# Altium schematic sheet MCU.SchDoc
size A3; SheetNumber: 1; SheetTotal: 1
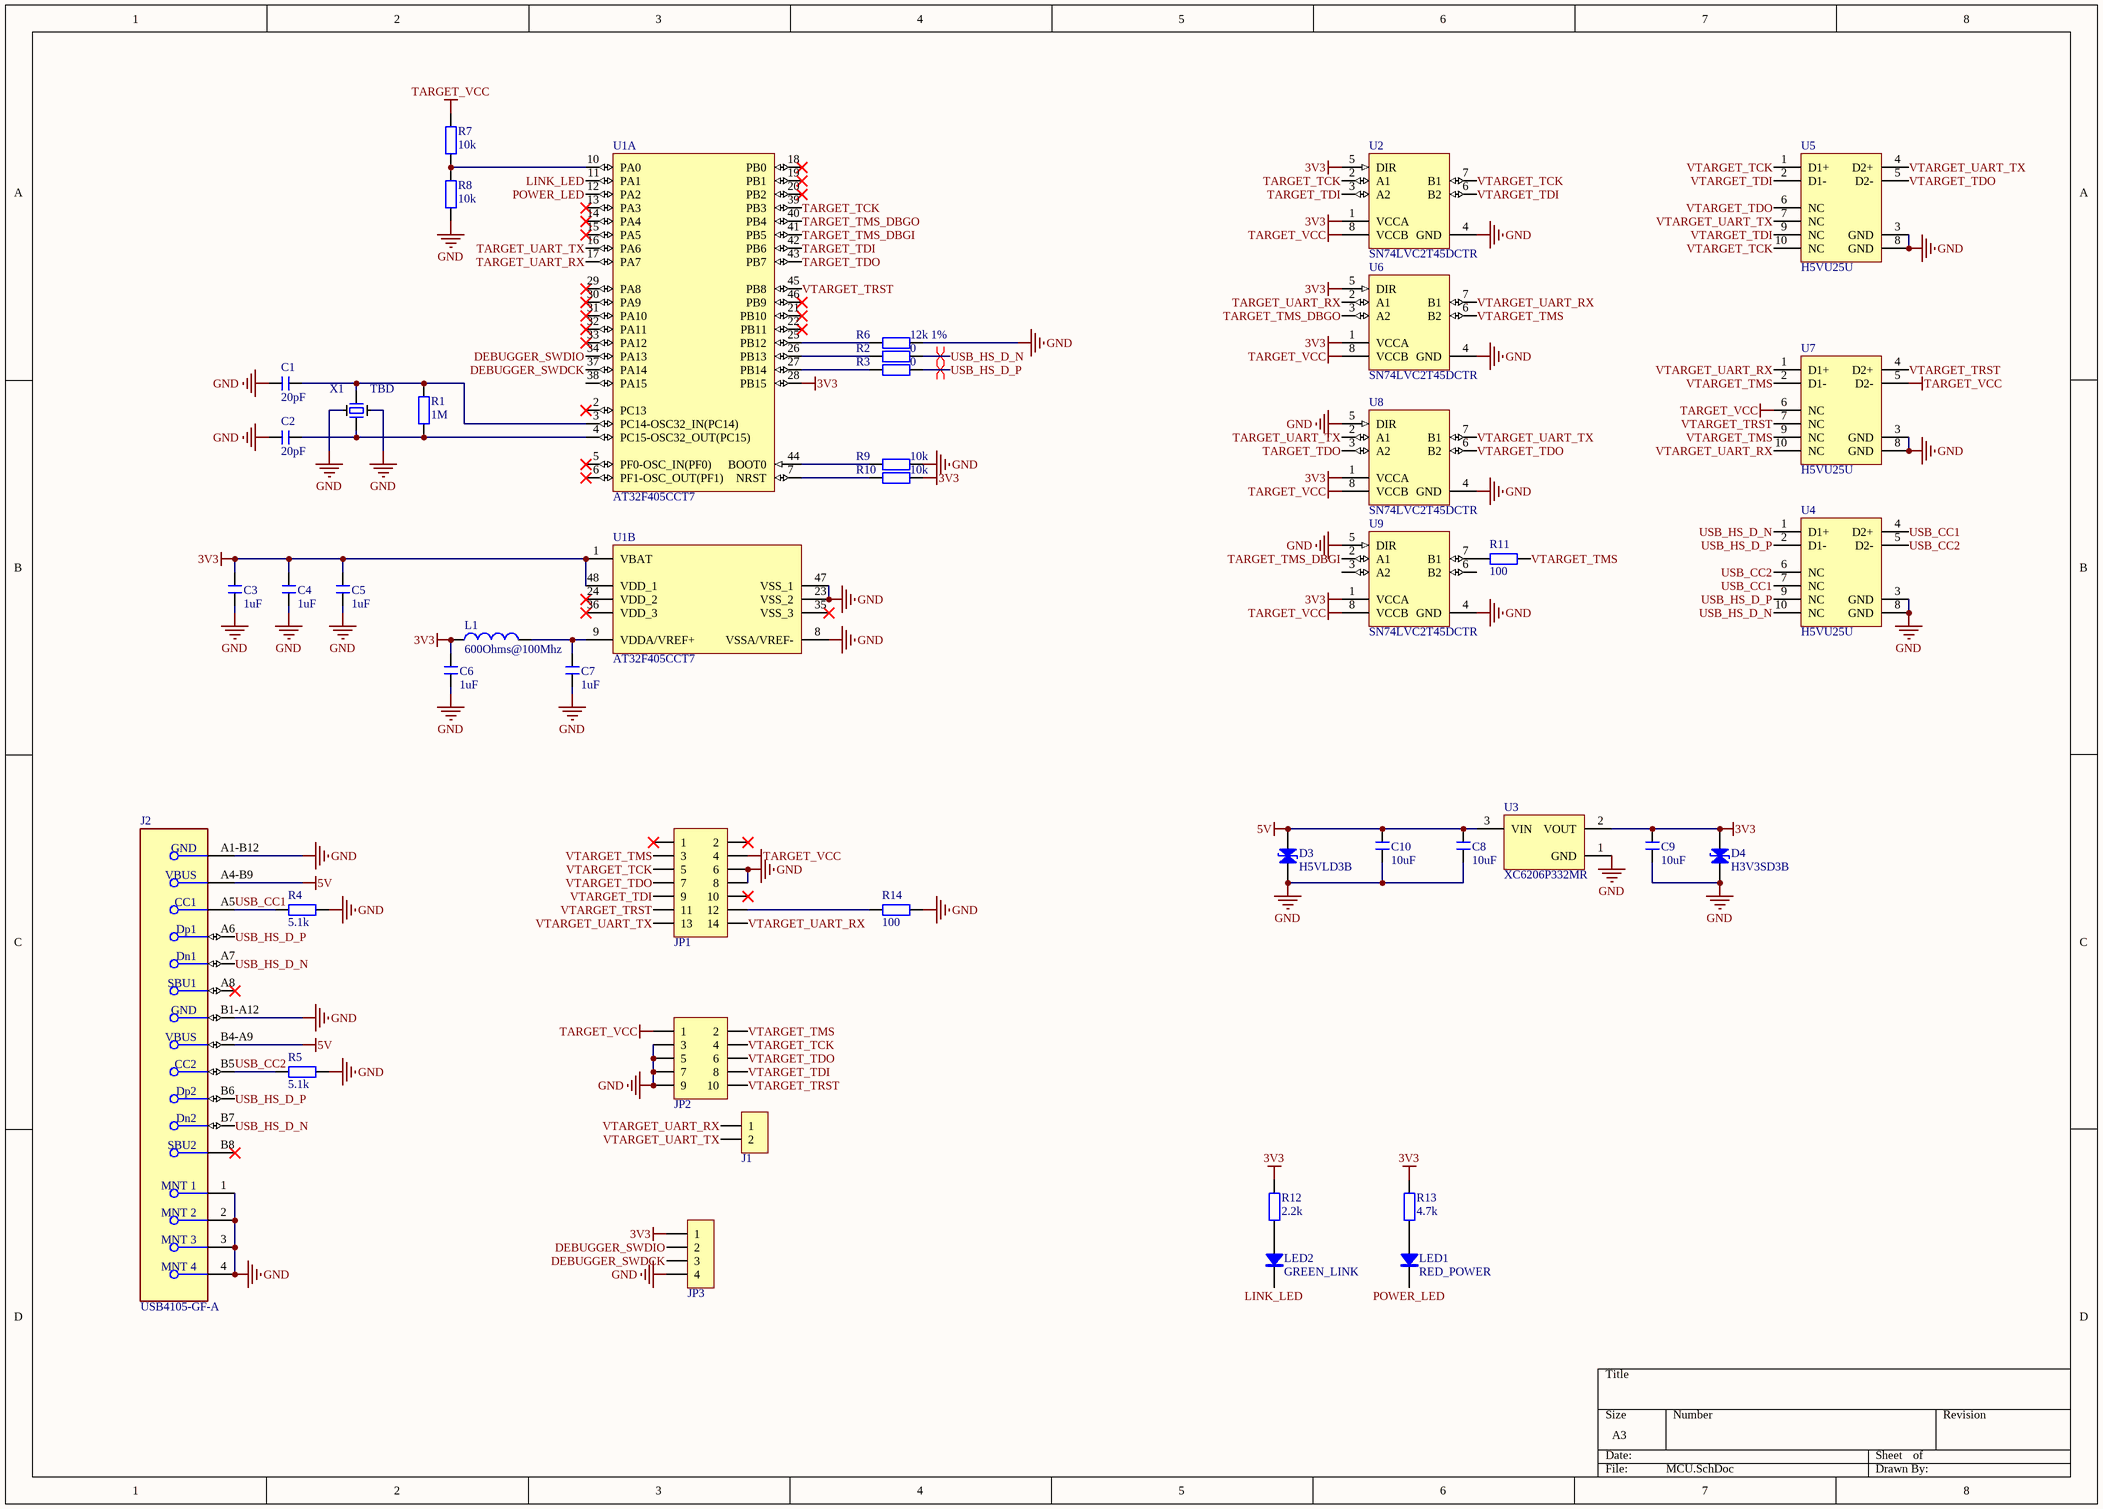
[diagram p0: MCU.SchDoc]

## Parts
C1  20pF  [C0402]
C2  20pF  [C0402]
C3  1uF  [C0402]
C4  1uF  [C0402]
C5  1uF  [C0402]
C6  1uF  [C0402]
C7  1uF  [C0402]
C8  10uF  [C0603]
C9  10uF  [C0603]
C10  10uF  [C0603]
D3  H5VLD3B  [SOD-323]
D4  H3V3SD3B  [SOD-323]
J1  HDR-1X2  [HDR2.54-LI-2P]  (value not drawn)
J2  USB4105-GF-A  [FP-USB4105-GF-A-MFG]
JP1  Header 2X7  [HDR1.27-LI-2x7P]  (value not drawn)
JP2  Header 5X2  [HDR2.54-LI-2x5P]  (value not drawn)
JP3  HDR-1X4  [HDR2.54-WS-4P]  (value not drawn)
L1  600Ohms@100Mhz  [L 0603_L]
LED1  RED_POWER  [LED 0603R]
LED2  GREEN_LINK  [LED 0603G]
R1  1M  [R0402]
R2  0  [R0402]
R3  0  [R0402]
R4  5.1k  [R0402]
R5  5.1k  [R0402]
R6  12k 1%  [R0402]
R7  10k  [R0402]
R8  10k  [R0402]
R9  10k  [R0402]
R10  10k  [R0402]
R11  100  [R0402]
R12  2.2k  [R0402]
R13  4.7k  [R0402]
R14  100  [R0402]
U1  AT32F405CCT7  [STM-LQFP48_N]  (parts A,B of 2)
U2  SN74LVC2T45DCTR  [DCT0008A_N]
U3  XC6206P332MR  [SOT-23-TT3_N]
U4  H5VU25U  [DQA0010A_V]
U5  H5VU25U  [DQA0010A_V]
U6  SN74LVC2T45DCTR  [DCT0008A_N]
U7  H5VU25U  [DQA0010A_V]
U8  SN74LVC2T45DCTR  [DCT0008A_N]
U9  SN74LVC2T45DCTR  [DCT0008A_N]
X1  TBD  [3225]

## Nets
3V3: C3.1 C4.1 C5.1 C6.1 C9.1 D4.1(A) JP3.1 L1.1 R10.1 R12.1 R13.1 U1.1(VBAT) U1.28(PB15) U1.48(VDD_1) U2.1(VCCA) U2.5(DIR) U3.2(VOUT) U6.1(VCCA) U6.5(DIR) U8.1(VCCA) U9.1(VCCA)
5V: C8.1 C10.1 D3.1(A) J2.A4-B9(VBUS) J2.B4-A9(VBUS) U3.3(VIN)
GND: C1.2 C2.2 C3.2 C4.2 C5.2 C6.2 C7.2 C8.2 C9.2 C10.2 D3.2(K) D4.2(K) J2.1(MNT_1) J2.2(MNT_2) J2.3(MNT_3) J2.4(MNT_4) J2.A1-B12(GND) J2.B1-A12(GND) JP1.6 JP1.8 JP2.3 JP2.5 JP2.7 JP2.9 JP3.4 R4.1 R5.1 R6.1 R8.1 R9.1 R14.1 U1.8(VSSA/VREF-) U1.23(VSS_2) U1.47(VSS_1) U2.4(GND) U3.1(GND) U4.3(GND) U4.8(GND) U5.3(GND) U5.8(GND) U6.4(GND) U7.3(GND) U7.8(GND) U8.4(GND) U8.5(DIR) U9.4(GND) U9.5(DIR) X1.2 X1.4
TARGET_VCC: JP1.4 JP2.1 R7.2 U2.8(VCCB) U6.8(VCCB) U7.5(D2-) U7.6(NC) U8.8(VCCB) U9.8(VCCB)
DEBUGGER_SWDCK: JP3.3 U1.37(PA14)
DEBUGGER_SWDIO: JP3.2 U1.34(PA13)
LINK_LED: LED2.2(K) U1.11(PA1)
POWER_LED: LED1.2(K) U1.12(PA2)
TARGET_TCK: U1.39(PB3) U2.2(A1)
TARGET_TDI: U1.42(PB6) U2.3(A2)
TARGET_TDO: U1.43(PB7) U8.3(A2)
TARGET_TMS_DBGI: U1.41(PB5) U9.2(A1)
TARGET_TMS_DBGO: U1.40(PB4) U6.3(A2)
TARGET_UART_RX: U1.17(PA7) U6.2(A1)
TARGET_UART_TX: U1.16(PA6) U8.2(A1)
USB_CC1: J2.A5(CC1) R4.2 U4.4(D2+) U4.7(NC)
USB_CC2: J2.B5(CC2) R5.2 U4.5(D2-) U4.6(NC)
USB_HS_D_N: J2.A7(Dn1) J2.B7(Dn2) R2.1 U4.1(D1+) U4.10(NC)
USB_HS_D_P: J2.A6(Dp1) J2.B6(Dp2) R3.1 U4.2(D1-) U4.9(NC)
VTARGET_TCK: JP1.5 JP2.4 U2.7(B1) U5.1(D1+) U5.10(NC)
VTARGET_TDI: JP1.9 JP2.8 U2.6(B2) U5.2(D1-) U5.9(NC)
VTARGET_TDO: JP1.7 JP2.6 U5.5(D2-) U5.6(NC) U8.6(B2)
VTARGET_TMS: JP1.3 JP2.2 R11.1 U6.6(B2) U7.2(D1-) U7.9(NC)
VTARGET_TRST: JP1.11 JP2.10 U1.45(PB8) U7.4(D2+) U7.7(NC)
VTARGET_UART_RX: J1.1 JP1.14 U6.7(B1) U7.1(D1+) U7.10(NC)
VTARGET_UART_TX: J1.2 JP1.13 U5.4(D2+) U5.7(NC) U8.7(B1)
NetC1_1: C1.1 R1.2 U1.3(PC14-OSC32_IN(PC14)) X1.3
NetC2_1: C2.1 R1.1 U1.4(PC15-OSC32_OUT(PC15)) X1.1
NetC7_1: C7.1 L1.2 U1.9(VDDA/VREF+)
NetJP1_12: JP1.12 R14.2
NetLED1_1: LED1.1(A) R13.2
NetLED2_1: LED2.1(A) R12.2
NetR2_2: R2.2 U1.26(PB13)
NetR3_2: R3.2 U1.27(PB14)
NetR6_2: R6.2 U1.25(PB12)
NetR7_1: R7.1 R8.2 U1.10(PA0)
NetR9_2: R9.2 U1.44(BOOT0)
NetR10_2: R10.2 U1.7(NRST)
NetR11_2: R11.2 U9.7(B1)

Not connected (* = marked no-connect by the designer): J2 A8(SBU1)* B8(SBU2)*; JP1 1* 2* 10*; U1 2(PC13)* 5(PF0-OSC_IN(PF0))* 6(PF1-OSC_OUT(PF1))* 13(PA3)* 14(PA4)* 15(PA5)* 18(PB0)* 19(PB1)* 20(PB2)* 21(PB10)* 22(PB11)* 24(VDD_2)* 29(PA8)* 30(PA9)* 31(PA10)* 32(PA11)* 33(PA12)* 35(VSS_3)* 36(VDD_3)* 38(PA15) 46(PB9)*; U9 3(A2) 6(B2)

## Layout directives
differential pair: USB_HS_D_N, USB_HS_D_P

## Library data of the parts
C1-C10 = C
D3 D4 = Generic_BiTVS: 瞬态电压抑制二极管; 版权归属: 源创客; BOM名称: 瞬态电压抑制二极管; 学习资源: www.ooocke.com
J1 = Header 2: BOM名称: 2P接插件; 版权归属: 源创客; 学习资源: www.ooocke.com
J2 = CMP-245163-000001-1: CONN RCPT USB2.0 TYPEC 5A; Manufacturer: GCT; Voltage Rating: 20V; Is Female: yes; Current Rating: 5/6.25/1.25/0.25A; Number Of Contacts: 16; Conn Orientation: Right Angle; Device Class L1: Connectors; Category: Conn; Lead Free: Yes; RoHS: TRUE; Temperature Range High: +85°C; Digikey Description: CONN RCPT USB2.0 TYPEC 5A; Device Class L3: unset; ComponentLink2Description: Datasheet; Manufacturer Part Number: USB4105-GF-A; Package: 0; Usb Standard: USB 2.0; Device Class L2: USB Connectors; Automotive: No; Temperature Range Low: -40°C; Height: 3.46mm; Temperature: -40°C to +85°C; Contact Material: Gold,Nickel; ComponentLink2URL: https://gct.co/files/drawings/usb4105.pdf; Octopart: https://octopart.com/usb4105-gf-a-gct-106627878
JP1 = Header 7X2: 7*2P接插件; 版权归属: 源创客; BOM名称: 7*2P接插件; 学习资源: www.ooocke.com
JP2 = Header 5X2: 5*2P接插件; 版权归属: 源创客; BOM名称: 5*2P接插件; 学习资源: www.ooocke.com
JP3 = Header 4: 4P接插件; 版权归属: 源创客; BOM名称: 4P接插件; 学习资源: www.ooocke.com
L1 = L
LED1 LED2 = D
R1-R14 = R
U1 = CMP-0572-00014-2: ARM Cortex-M4 32-bit MCU, 128 KB Flash, 32 KB Internal RAM, 37 I/Os, 48-pin LQFP, -40 to 85 degC, Tray; PartNumber: STM32F303CBT6; Internal RAM Size (kB): 32; Supply Voltage(Vcc) min (V): 2; Operating Frequency(F) (Processor speed) (MHz): 72; FLASH Size (Prog) (kB): 128; I/Os (High Current): 37; D/A Converter: 2x12-bit (2 Channel); PackageDescription: 48-Pin Low Profile Quad Flat Package, 7 x 7 mm Body, 0.5 mm Pitch; ComponentLink1URL: http://www.st.com/web/en/home.html; Packing: Tray; ComponentLink1Description: Manufacturer URL; DatasheetVersion: Rev. 6; Mounting Technology: Surface Mount; Core: ARM Cortex-M4; ComponentLink2URL: http://www.st.com/st-web-ui/static/active/en/resource/technical/document/datasheet/DM00058181.pdf; ComponentLink3URL: http://www.st.com/st-web-ui/static/active/en/resource/technical/document/datasheet/DM00058181.pdf; PackageReference: LQFP48; ComponentLink3Description: Package Specification; PackageVersion: Rev. 6, 06/2013; ComponentLink2Description: Datasheet
U2 U6 U8 U9 = CMP-0859-00006-4: Dual-Bit Dual Supply Transceiver with Configurable Voltage Translation and 3-State Outputs, DCT0008A, LARGE T&R; Manufacturer: Texas Instruments; Rating: Military; Input Type: CMOS/TTL; Schmitt Trigger: No; ICC @ Nom Voltage(Max)(mA): 0.004; Bits(#): 2; Logic: True; tpd @ Nom Voltage(Max)(ns): 17.7,10.3,8.3,7.2; VCC(Min)(V): 1.65; Voltage(Nom)(V): 1.8,2.5,3.3,5; Output Type: CMOS; F @ Nom Voltage(Max)(Mhz): 150; Technology Family: LVC; VCC(Max)(V): 5.5; Output Drive (IOL/IOH)(Max)(mA): 32/-32; 3-State Output: Yes; Sub-Family: Dual Supply Translator; Operating Temperature Range(C): -40 to 85; DatasheetVersion: SCES516J; Generic Part Number: SN74LVC2T45; PackageReference: DCT0008A
U3 = CMP-0136-00791-1: Low Quiescent Current LDO, 3-Pin SOT-23, Extended Temperature, Tape and Reel; PackageVersion: revBB, Aug-2009; Code_IPC: SOT23-3; PackageReference: SOT-23-TT3; DatasheetVersion: revB, Feb-2007; PackageDescription: 3-Lead Plastic Small Outline Transistor (TT) [SOT-23]
U4 U5 U7 = CMP-0326-00027-3: ESD Solution for Super-Speed (6 GBPS) USB 3.0 Interface, 4 Channels, -40 to +85 degC, 10-pin SON (DQA), Green (RoHS & no Sb/Br); PartNumber: TPD4EUSB30DQAR; Manufacturer: Texas Instruments; Differential Capacitance(pF): 0.05; Serial ATA / eSATA: TRUE; IO Capacitance(Typ)(pF): 0.8; IO Leakage Current(nA): 10; IEC 61000-4-2 Air-Gap(+/- kV): 8; ComponentLink3Description: URL Link1; DatasheetVersion: SLVSAC2C; ComponentLink2URL: http://www.ti.com/general/docs/lit/getliterature.tsp?genericPartNumber=TPD4EUSB30&fileType=pdf; USB Super Speed: TRUE; Eco-Plan: Green (RoHS & no Sb/Br); Mounting Technology: Surface Mount; 1394 / Firewire: TRUE; PackageVersion: revB, Sep-2009; SubFamily: ESD Solution; USB Full Speed: TRUE; USB High Speed: TRUE; ComponentLink2Description: Datasheet; ComponentLink1URL: http://www.ti.com/; IEC 61000-4-2 Contact(+/- kV): 8; Breakdown Voltage(Min)(V): 8; PackageReference: DQA0010A; ComponentLink1Description: Manufacturer URL; PackageDescription: 10-Pin Plastic Small Outline No-Lead, 1 x 2.5 x 0.55 mm Body, 0.5 mm Pitch; ComponentLink3URL: SamplesURL:http://www.ti.com/product/tpd4eusb30#samples; HDMI: TRUE
X1 = X